# EAGLE schematic BFMC_Powerboard v0.2 (EAGLE 9.6.2)

## Sheet 1 of 3: Load SW and current sensing
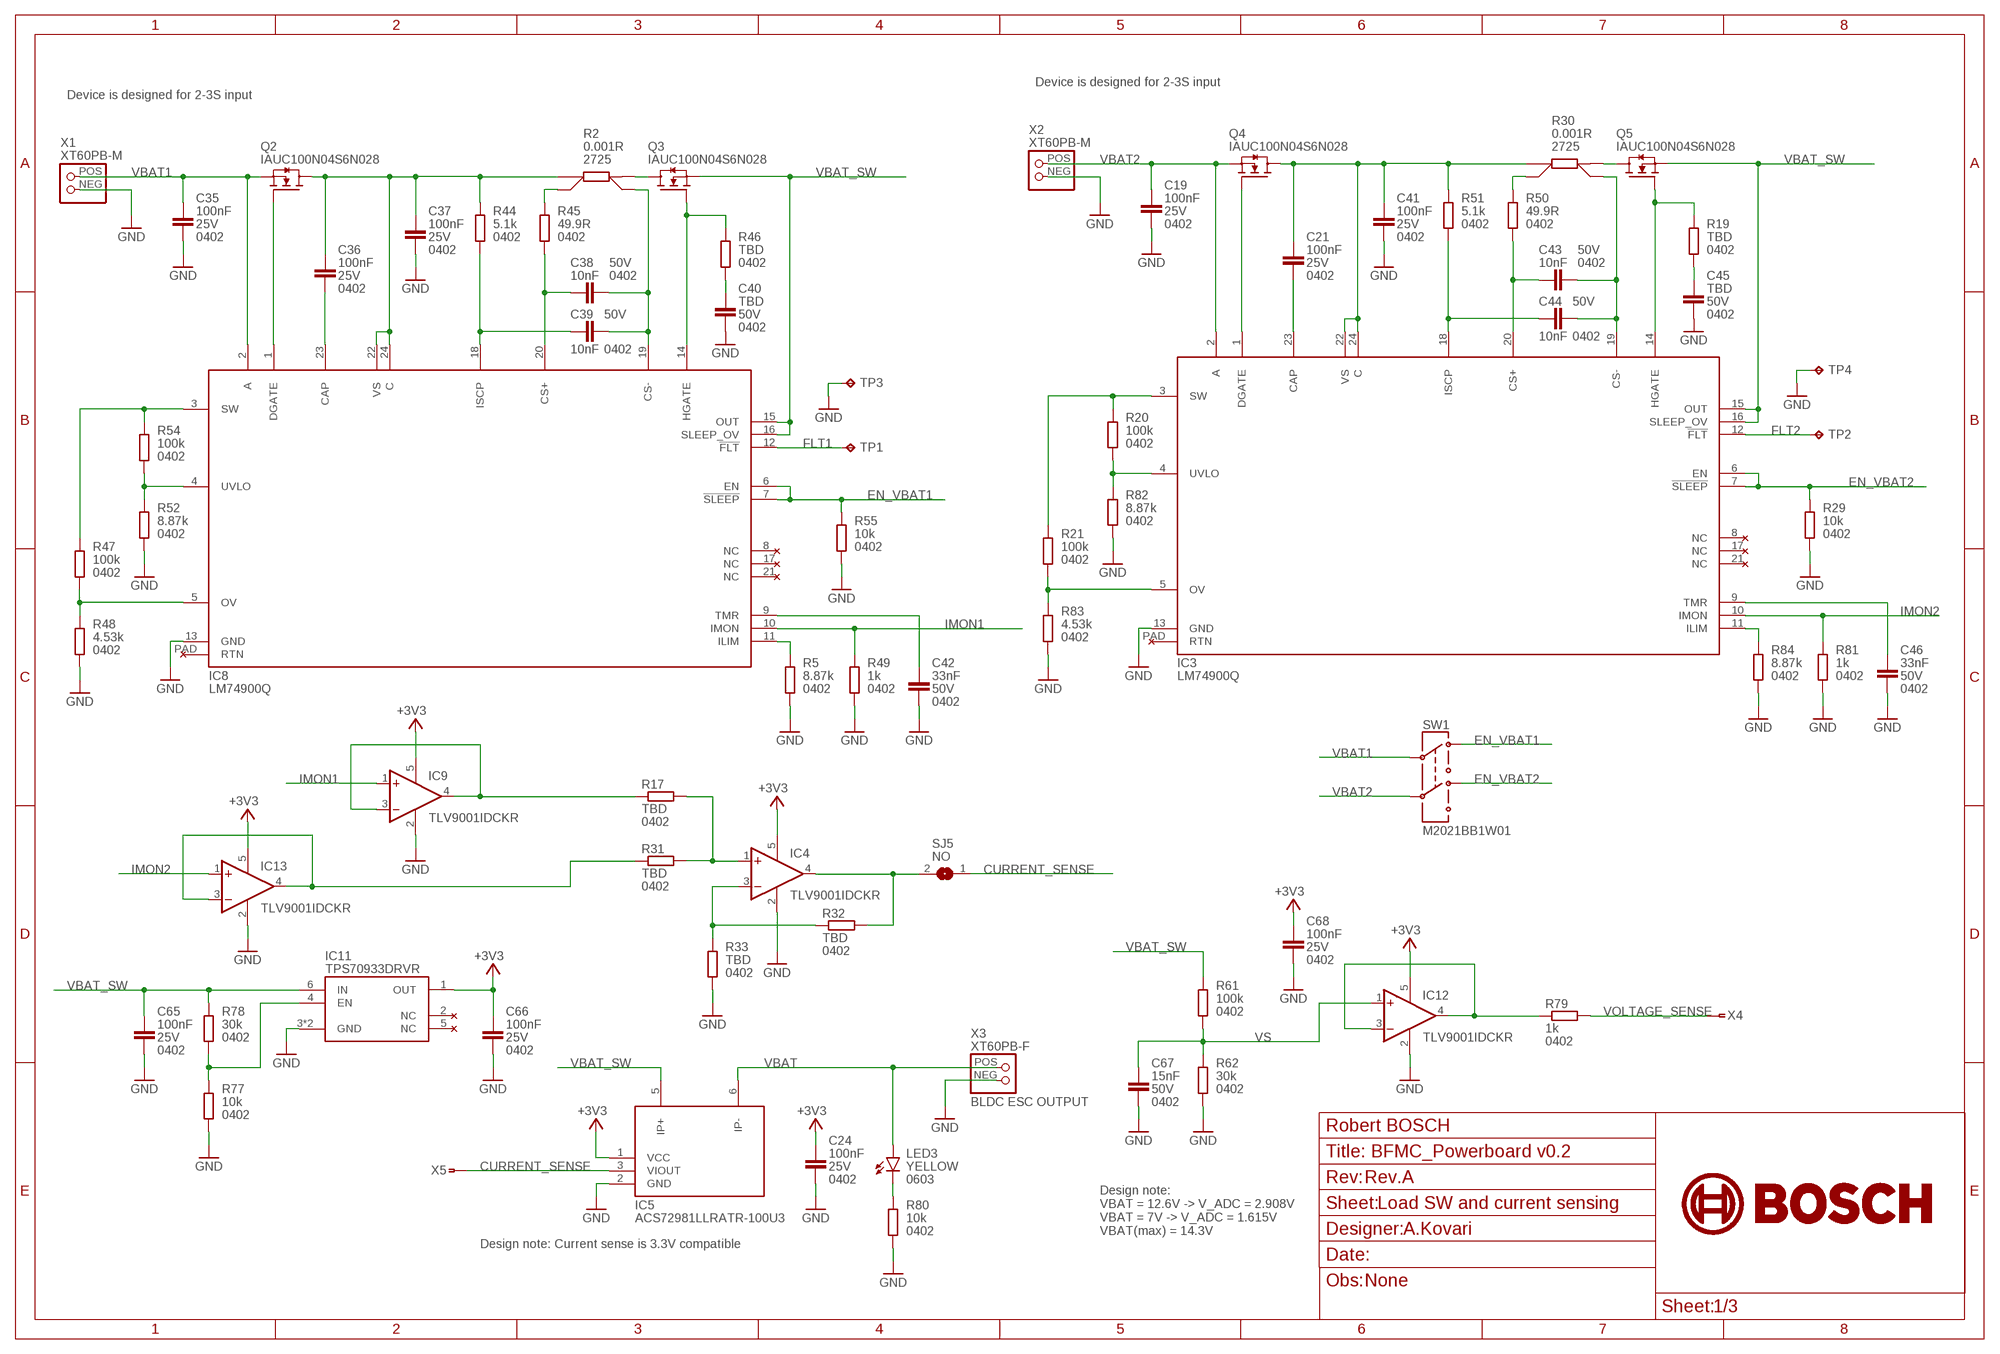
[diagram p0: schematic, sheet 1]
FRAME1 (_SCH_FRAME_A3): DNAME: A.Kovari; OBS: None; REVNUM: Rev.A

### Parts
C19  100nF  CL05B104KA5NNNC  [C0402_IPC]
C21  100nF  CL05B104KA5NNNC  [C0402_IPC]
C24  100nF  CL05B104KA5NNNC  [C0402_IPC]
C35  100nF  CL05B104KA5NNNC  [C0402_IPC]
C36  100nF  CL05B104KA5NNNC  [C0402_IPC]
C37  100nF  CL05B104KA5NNNC  [C0402_IPC]
C38  10nF  GCM155R71H103KA55D  [C0402_IPC]
C39  10nF  GCM155R71H103KA55D  [C0402_IPC]
C40  TBD  GCM155R71H103KA55D  [C0402_IPC]
C41  100nF  CL05B104KA5NNNC  [C0402_IPC]
C42  33nF  CGA2B3X7R1H333K050BB  [C0402_IPC]
C43  10nF  GCM155R71H103KA55D  [C0402_IPC]
C44  10nF  GCM155R71H103KA55D  [C0402_IPC]
C45  TBD  GCM155R71H103KA55D  [C0402_IPC]
C46  33nF  CGA2B3X7R1H333K050BB  [C0402_IPC]
C65  100nF  CL05B104KA5NNNC  [C0402_IPC]
C66  100nF  CL05B104KA5NNNC  [C0402_IPC]
C67  15nF  GRM155R71H153KA12J  [C0402_IPC]
C68  100nF  CL05B104KA5NNNC  [C0402_IPC]
IC3  LM74900Q  [QFN24-4X4]
IC4  TLV9001IDCKR  [SC70-5]
IC5  ACS72981LLRATR-100U3  [ACS72981]
IC8  LM74900Q  [QFN24-4X4]
IC9  TLV9001IDCKR  [SC70-5]
IC11  TPS70933DRVR  [WSON6_2X2MM_NO_SILK]
IC12  TLV9001IDCKR  [SC70-5]
IC13  TLV9001IDCKR  [SC70-5]
LED3  YELLOW  150060YS75000  [CHIPLED_0603]
Q2  IAUC100N04S6N028  IAUC100N04S6N028ATMA1  [PG-TDSON-8]
Q3  IAUC100N04S6N028  IAUC100N04S6N028ATMA1  [PG-TDSON-8]
Q4  IAUC100N04S6N028  IAUC100N04S6N028ATMA1  [PG-TDSON-8]
Q5  IAUC100N04S6N028  IAUC100N04S6N028ATMA1  [PG-TDSON-8]
R2  0.001R  CST272FK-13-R001AA  [CRS272]
R5  8.87k  RC0402FR-078K87L  [R0402_IPC]
R17  TBD  RC0402FR-131KL  [R0402_IPC]
R19  TBD  RC0402FR-1349R9L  [R0402_IPC]
R20  100k  RC0402FR-13100KL  [R0402_IPC]
R21  100k  RC0402FR-13100KL  [R0402_IPC]
R29  10k  RC0402FR-1310KL  [R0402_IPC]
R30  0.001R  CST272FK-13-R001AA  [CRS272]
R31  TBD  RC0402FR-131KL  [R0402_IPC]
R32  TBD  RC0402FR-131KL  [R0402_IPC]
R33  TBD  RC0402FR-131KL  [R0402_IPC]
R44  5.1k  RC0402FR-135K1L  [R0402_IPC]
R45  49.9R  RC0402FR-1349R9L  [R0402_IPC]
R46  TBD  RC0402FR-1349R9L  [R0402_IPC]
R47  100k  RC0402FR-13100KL  [R0402_IPC]
R48  4.53k  RC0402FR-074K53L  [R0402_IPC]
R49  1k  RC0402FR-131KL  [R0402_IPC]
R50  49.9R  RC0402FR-1349R9L  [R0402_IPC]
R51  5.1k  RC0402FR-135K1L  [R0402_IPC]
R52  8.87k  RC0402FR-078K87L  [R0402_IPC]
R54  100k  RC0402FR-13100KL  [R0402_IPC]
R55  10k  RC0402FR-1310KL  [R0402_IPC]
R61  100k  RC0402FR-13100KL  [R0402_IPC]
R62  30k  RC0402FR-1330KL  [R0402_IPC]
R77  10k  RC0402FR-1310KL  [R0402_IPC]
R78  30k  RC0402FR-1330KL  [R0402_IPC]
R79  1k  RC0402FR-131KL  [R0402_IPC]
R80  10k  RC0402FR-1310KL  [R0402_IPC]
R81  1k  RC0402FR-131KL  [R0402_IPC]
R82  8.87k  RC0402FR-078K87L  [R0402_IPC]
R83  4.53k  RC0402FR-074K53L  [R0402_IPC]
R84  8.87k  RC0402FR-078K87L  [R0402_IPC]
SJ5  NO  SJ_1.5X1_NO  [SJ_1X1.5_NO]
SW1  M2021BB1W01  [M2021BB1W01]
TP1  TPTP13R  [TP13R]
TP2  TPTP13R  [TP13R]
TP3  TPTP13R  [TP13R]
TP4  TPTP13R  [TP13R]
X1  XT60PB-M  [XT60PB]
X2  XT60PB-M  [XT60PB]
X3  XT60PB-F  [XT60PB]
X4  ZFKDSA1-W-6,35  [1704994]
X5  ZFKDSA1-W-6,35  [1704994]

### Nets
+3V3: C24.1 C66.1 C68.1 IC4.5(V+) IC5.1(VCC) IC9.5(V+) IC11.1(OUT) IC12.5(V+) IC13.5(V+) ; also sheet 2,3
CURRENT_SENSE: IC5.3(VIOUT) SJ5.1 X5.1 X5.2
EN_VBAT1: IC8.6(EN) IC8.7(!SLEEP) R55.2 SW1.3
EN_VBAT2: IC3.6(EN) IC3.7(!SLEEP) R29.2 SW1.6
FLT1: IC8.12(!FLT) TP1.TP
FLT2: IC3.12(!FLT) TP2.TP
GND: C19.2 C24.2 C35.2 C37.2 C40.1 C41.2 C42.2 C45.1 C46.2 C65.2 C66.2 C67.2 C68.2 IC3.13(GND) IC4.2(V-) IC5.2(GND) IC8.13(GND) IC9.2(V-) IC11.3(GND) IC11.EP(GND) IC12.2(V-) IC13.2(V-) R5.1 R29.1 R33.1 R48.1 R49.1 R52.1 R55.1 R62.1 R77.1 R80.1 R81.1 R82.1 R83.1 R84.1 TP3.TP TP4.TP X1.NEG X2.NEG X3.NEG ; also sheet 2,3
IMON1: IC8.10(IMON) IC9.1(+IN) R49.2
IMON2: IC3.10(IMON) IC13.1(+IN) R81.2
N$12: IC8.1(DGATE) Q2.4(G)
N$15: IC3.1(DGATE) Q4.4(G)
N$17: C21.2 IC3.23(CAP)
N$18: C21.1 C41.1 IC3.22(VS) IC3.24(C) Q4.5(D) Q4.6(D) Q4.7(D) Q4.8(D) Q4.TH(D) R30.1A R51.2
N$19: IC3.14(HGATE) Q5.4(G) R19.2
N$20: IC4.1(+IN) R17.2 R31.2
N$22: C44.1 IC3.18(ISCP) R51.1
N$23: R30.1B R50.2
N$24: C43.2 C44.2 IC3.19(CS-) R30.2B
N$25: Q5.5(D) Q5.6(D) Q5.7(D) Q5.8(D) Q5.TH(D) R30.2A
N$26: IC4.4(OUT) R32.2 SJ5.2
N$27: C43.1 IC3.20(CS+) R50.1
N$28: C45.2 R19.1
N$29: IC4.3(-IN) R32.1 R33.2
N$33: IC9.3(-IN) IC9.4(OUT) R17.1
N$34: IC13.3(-IN) IC13.4(OUT) R31.1
N$43: C36.2 IC8.23(CAP)
N$45: C36.1 C37.1 IC8.22(VS) IC8.24(C) Q2.5(D) Q2.6(D) Q2.7(D) Q2.8(D) Q2.TH(D) R2.1A R44.2
N$46: IC8.14(HGATE) Q3.4(G) R46.2
N$47: C39.1 IC8.18(ISCP) R44.1
N$48: IC8.3(SW) R47.2 R54.2
N$49: R2.1B R45.2
N$50: C38.2 C39.2 IC8.19(CS-) R2.2B
N$51: Q3.5(D) Q3.6(D) Q3.7(D) Q3.8(D) Q3.TH(D) R2.2A
N$52: C38.1 IC8.20(CS+) R45.1
N$53: C40.2 R46.1
N$54: IC8.11(ILIM) R5.2
N$55: IC3.11(ILIM) R84.2
N$56: C42.1 IC8.9(TMR)
N$57: IC8.4(UVLO) R52.2 R54.1
N$61: IC8.5(OV) R47.1 R48.2
N$78: IC12.3(-IN) IC12.4(OUT) R79.1
N$79: LED3.C R80.2
N$91: IC11.4(EN) R77.2 R78.1
N$92: C46.1 IC3.9(TMR)
N$93: IC3.3(SW) R20.2 R21.2
N$94: IC3.4(UVLO) R20.1 R82.2
N$95: IC3.5(OV) R21.1 R83.2
VBAT: IC5.6(IP-) LED3.A X3.POS ; also sheet 2,3
VBAT1: C35.1 IC8.2(A) Q2.1(S) Q2.2(S) Q2.3(S) SW1.2 X1.POS
VBAT2: C19.1 IC3.2(A) Q4.1(S) Q4.2(S) Q4.3(S) SW1.5 X2.POS
VBAT_SW: C65.1 IC3.15(OUT) IC3.16(SLEEP_OV) IC5.5(IP+) IC8.15(OUT) IC8.16(SLEEP_OV) IC11.6(IN) Q3.1(S) Q3.2(S) Q3.3(S) Q5.1(S) Q5.2(S) Q5.3(S) R61.2 R78.2
VOLTAGE_SENSE: R79.2 X4.1 X4.2
VS: C67.1 IC12.1(+IN) R61.1 R62.2
Unconnected: IC3.8(NC) IC3.17(NC) IC3.21(NC) IC3.PAD(RTN) IC8.8(NC) IC8.17(NC) IC8.21(NC) IC8.PAD(RTN) IC11.2(NC) IC11.5(NC)

### Notes on the sheet
- Device is designed for 2-3S input
- Device is designed for 2-3S input
- BLDC ESC OUTPUT
- Design note: 
  VBAT = 12.6V -> V_ADC = 2.908V
  VBAT = 7V -> V_ADC = 1.615V
  VBAT(max) = 14.3V
- Design note: Current sense is 3.3V compatible

## Sheet 2 of 3: DCDC Buck converters
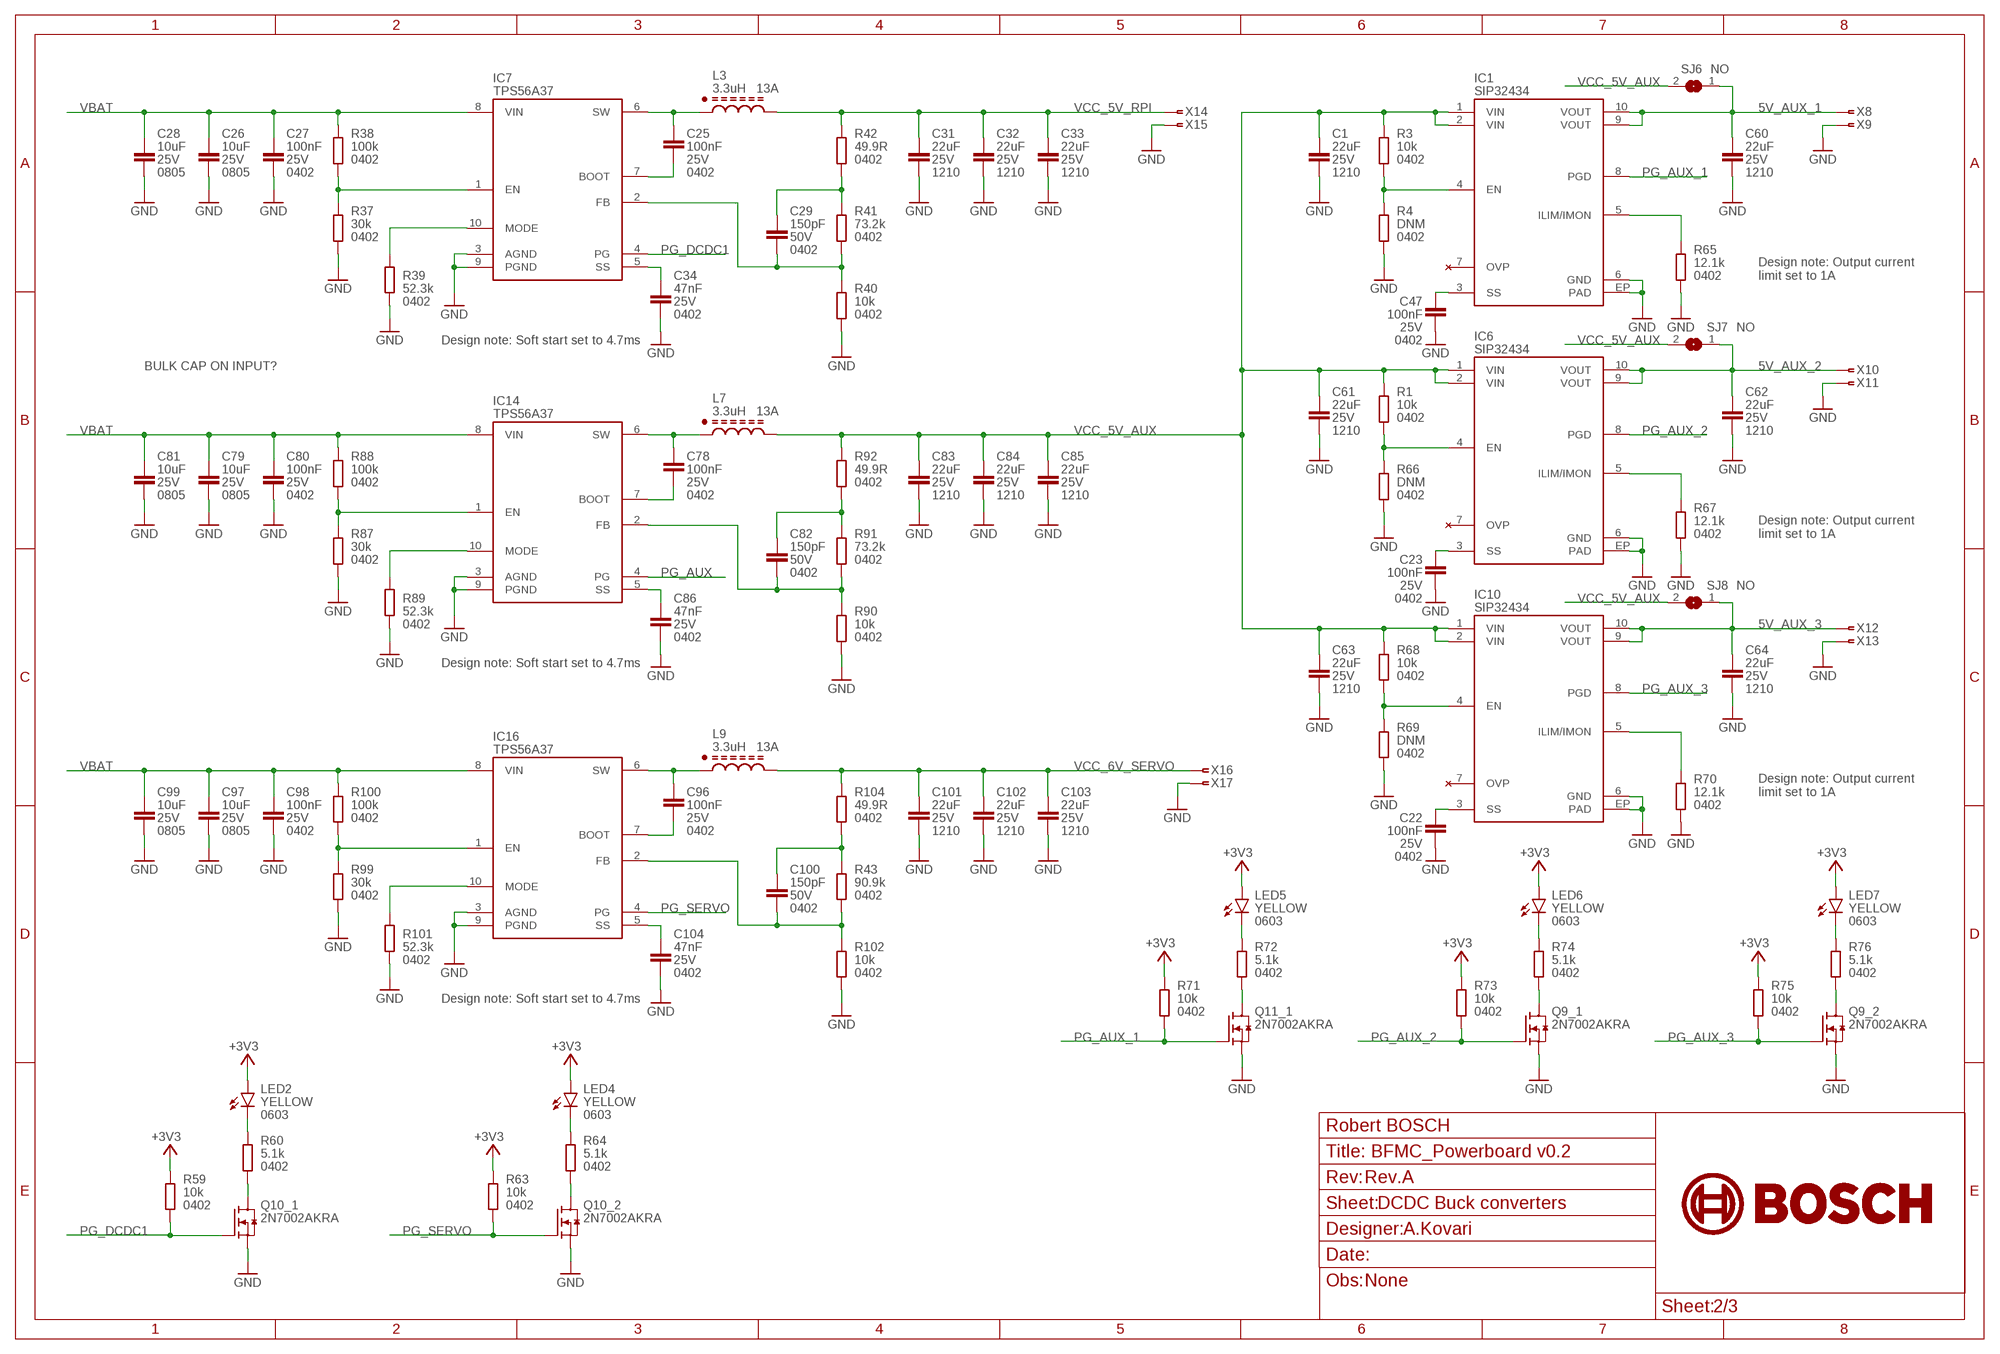
[diagram p1: schematic, sheet 2]
FRAME3 (_SCH_FRAME_A3): DNAME: A.Kovari; OBS: None; REVNUM: Rev.A

### Parts
C1  22uF  CL32A226KAJNNNE  [C1210]
C22  100nF  CL05B104KA5NNNC  [C0402_IPC]
C23  100nF  CL05B104KA5NNNC  [C0402_IPC]
C25  100nF  CL05B104KA5NNNC  [C0402_IPC]
C26  10uF  GRM21BR61E106KA73K  [C0805]
C27  100nF  CL05B104KA5NNNC  [C0402_IPC]
C28  10uF  GRM21BR61E106KA73K  [C0805]
C29  150pF  GCM1555C1H151JA16J  [C0402_IPC]
C31  22uF  CL32A226KAJNNNE  [C1210]
C32  22uF  CL32A226KAJNNNE  [C1210]
C33  22uF  CL32A226KAJNNNE  [C1210]
C34  47nF  CL05B473KA5NNNC  [C0402_IPC]
C47  100nF  CL05B104KA5NNNC  [C0402_IPC]
C60  22uF  CL32A226KAJNNNE  [C1210]
C61  22uF  CL32A226KAJNNNE  [C1210]
C62  22uF  CL32A226KAJNNNE  [C1210]
C63  22uF  CL32A226KAJNNNE  [C1210]
C64  22uF  CL32A226KAJNNNE  [C1210]
C78  100nF  CL05B104KA5NNNC  [C0402_IPC]
C79  10uF  GRM21BR61E106KA73K  [C0805]
C80  100nF  CL05B104KA5NNNC  [C0402_IPC]
C81  10uF  GRM21BR61E106KA73K  [C0805]
C82  150pF  GCM1555C1H151JA16J  [C0402_IPC]
C83  22uF  CL32A226KAJNNNE  [C1210]
C84  22uF  CL32A226KAJNNNE  [C1210]
C85  22uF  CL32A226KAJNNNE  [C1210]
C86  47nF  CL05B473KA5NNNC  [C0402_IPC]
C96  100nF  CL05B104KA5NNNC  [C0402_IPC]
C97  10uF  GRM21BR61E106KA73K  [C0805]
C98  100nF  CL05B104KA5NNNC  [C0402_IPC]
C99  10uF  GRM21BR61E106KA73K  [C0805]
C100  150pF  GCM1555C1H151JA16J  [C0402_IPC]
C101  22uF  CL32A226KAJNNNE  [C1210]
C102  22uF  CL32A226KAJNNNE  [C1210]
C103  22uF  CL32A226KAJNNNE  [C1210]
C104  47nF  CL05B473KA5NNNC  [C0402_IPC]
IC1  SIP32434  [DFN10-3X3]
IC6  SIP32434  [DFN10-3X3]
IC7  TPS56A37  [VQFN-HR-RPA]
IC10  SIP32434  [DFN10-3X3]
IC14  TPS56A37  [VQFN-HR-RPA]
IC16  TPS56A37  [VQFN-HR-RPA]
L3  3.3uH  EXLA1V0705-3R3-R  [EXLA1V0705]
L7  3.3uH  EXLA1V0705-3R3-R  [EXLA1V0705]
L9  3.3uH  EXLA1V0705-3R3-R  [EXLA1V0705]
LED2  YELLOW  150060YS75000  [CHIPLED_0603]
LED4  YELLOW  150060YS75000  [CHIPLED_0603]
LED5  YELLOW  150060YS75000  [CHIPLED_0603]
LED6  YELLOW  150060YS75000  [CHIPLED_0603]
LED7  YELLOW  150060YS75000  [CHIPLED_0603]
Q9  2N7002AKRA  [DFN1412-6]
Q10  2N7002AKRA  [DFN1412-6]
Q11  2N7002AKRA  [DFN1412-6]
R1  10k  RC0402FR-1310KL  [R0402_IPC]
R3  10k  RC0402FR-1310KL  [R0402_IPC]
R4  DNM  RC0402FR-1310KL  [R0402_IPC]
R37  30k  RC0402FR-1330KL  [R0402_IPC]
R38  100k  RC0402FR-13100KL  [R0402_IPC]
R39  52.3k  RC0402FR-1352K3L  [R0402_IPC]
R40  10k  RC0402FR-1310KL  [R0402_IPC]
R41  73.2k  RC0402FR-1373K2L  [R0402_IPC]
R42  49.9R  RC0402FR-1349R9L  [R0402_IPC]
R43  90.9k  RC0402FR-0790K9L  [R0402_IPC]
R59  10k  RC0402FR-1310KL  [R0402_IPC]
R60  5.1k  RC0402FR-135K1L  [R0402_IPC]
R63  10k  RC0402FR-1310KL  [R0402_IPC]
R64  5.1k  RC0402FR-135K1L  [R0402_IPC]
R65  12.1k  RC0402FR-0712K1L  [R0402_IPC]
R66  DNM  RC0402FR-1310KL  [R0402_IPC]
R67  12.1k  RC0402FR-0712K1L  [R0402_IPC]
R68  10k  RC0402FR-1310KL  [R0402_IPC]
R69  DNM  RC0402FR-1310KL  [R0402_IPC]
R70  12.1k  RC0402FR-0712K1L  [R0402_IPC]
R71  10k  RC0402FR-1310KL  [R0402_IPC]
R72  5.1k  RC0402FR-135K1L  [R0402_IPC]
R73  10k  RC0402FR-1310KL  [R0402_IPC]
R74  5.1k  RC0402FR-135K1L  [R0402_IPC]
R75  10k  RC0402FR-1310KL  [R0402_IPC]
R76  5.1k  RC0402FR-135K1L  [R0402_IPC]
R87  30k  RC0402FR-1330KL  [R0402_IPC]
R88  100k  RC0402FR-13100KL  [R0402_IPC]
R89  52.3k  RC0402FR-1352K3L  [R0402_IPC]
R90  10k  RC0402FR-1310KL  [R0402_IPC]
R91  73.2k  RC0402FR-1373K2L  [R0402_IPC]
R92  49.9R  RC0402FR-1349R9L  [R0402_IPC]
R99  30k  RC0402FR-1330KL  [R0402_IPC]
R100  100k  RC0402FR-13100KL  [R0402_IPC]
R101  52.3k  RC0402FR-1352K3L  [R0402_IPC]
R102  10k  RC0402FR-1310KL  [R0402_IPC]
R104  49.9R  RC0402FR-1349R9L  [R0402_IPC]
SJ6  NO  SJ_1.5X1_NO  [SJ_1X1.5_NO]
SJ7  NO  SJ_1.5X1_NO  [SJ_1X1.5_NO]
SJ8  NO  SJ_1.5X1_NO  [SJ_1X1.5_NO]
X8  ZFKDSA1-W-6,35  [1704994]
X9  ZFKDSA1-W-6,35  [1704994]
X10  ZFKDSA1-W-6,35  [1704994]
X11  ZFKDSA1-W-6,35  [1704994]
X12  ZFKDSA1-W-6,35  [1704994]
X13  ZFKDSA1-W-6,35  [1704994]
X14  ZFKDSA1-W-6,35  [1704994]
X15  ZFKDSA1-W-6,35  [1704994]
X16  ZFKDSA1-W-6,35  [1704994]
X17  ZFKDSA1-W-6,35  [1704994]

### Nets
5V_AUX_1: C60.1 IC1.9(VOUT) IC1.10(VOUT) SJ6.1 X8.1 X8.2
5V_AUX_2: C62.1 IC6.9(VOUT) IC6.10(VOUT) SJ7.1 X10.1 X10.2
5V_AUX_3: C64.1 IC10.9(VOUT) IC10.10(VOUT) SJ8.1 X12.1 X12.2
+3V3: LED2.A LED4.A LED5.A LED6.A LED7.A R59.2 R63.2 R71.2 R73.2 R75.2 ; also sheet 1,3
GND: C1.2 C22.2 C23.2 C26.2 C27.2 C28.2 C31.2 C32.2 C33.2 C34.2 C47.2 C60.2 C61.2 C62.2 C63.2 C64.2 C79.2 C80.2 C81.2 C83.2 C84.2 C85.2 C86.2 C97.2 C98.2 C99.2 C101.2 C102.2 C103.2 C104.2 IC1.6(GND) IC1.EP(PAD) IC6.6(GND) IC6.EP(PAD) IC7.3(AGND) IC7.9(PGND) IC10.6(GND) IC10.EP(PAD) IC14.3(AGND) IC14.9(PGND) IC16.3(AGND) IC16.9(PGND) Q9.1(_1:S) Q9.4(_2:S) Q10.1(_1:S) Q10.4(_2:S) Q11.1(_1:S) R4.1 R37.1 R39.1 R40.1 R65.1 R66.1 R67.1 R69.1 R70.1 R87.1 R89.1 R90.1 R99.1 R101.1 R102.1 X9.1 X9.2 X11.1 X11.2 X13.1 X13.2 X15.1 X15.2 X17.1 X17.2 ; also sheet 1,3
N$1: IC6.5(ILIM/IMON) R67.2
N$2: IC1.5(ILIM/IMON) R65.2
N$3: IC1.4(EN) R3.1 R4.2
N$30: C22.1 IC10.3(SS)
N$31: C23.1 IC6.3(SS)
N$32: C47.1 IC1.3(SS)
N$37: C25.1 IC7.6(SW) L3.1
N$38: C25.2 IC7.7(BOOT)
N$39: C34.1 IC7.5(SS)
N$40: IC7.1(EN) R37.2 R38.1
N$41: C29.2 IC7.2(FB) R40.2 R41.1
N$42: IC7.10(MODE) R39.2
N$44: C29.1 R41.2 R42.1
N$76: Q10.6(_1:D) Q10.7(_1:D) R60.1
N$77: LED2.C R60.2
N$80: Q10.3(_2:D) Q10.8(_2:D) R64.1
N$81: LED4.C R64.2
N$82: IC6.4(EN) R1.1 R66.2
N$83: IC10.5(ILIM/IMON) R70.2
N$84: IC10.4(EN) R68.1 R69.2
N$85: Q11.6(_1:D) Q11.7(_1:D) R72.1
N$86: LED5.C R72.2
N$87: Q9.6(_1:D) Q9.7(_1:D) R74.1
N$88: LED6.C R74.2
N$89: Q9.3(_2:D) Q9.8(_2:D) R76.1
N$90: LED7.C R76.2
N$99: C78.1 IC14.6(SW) L7.1
N$100: C78.2 IC14.7(BOOT)
N$101: IC14.1(EN) R87.2 R88.1
N$102: IC14.10(MODE) R89.2
N$103: C82.2 IC14.2(FB) R90.2 R91.1
N$104: C82.1 R91.2 R92.1
N$105: C86.1 IC14.5(SS)
N$113: C96.1 IC16.6(SW) L9.1
N$114: C96.2 IC16.7(BOOT)
N$115: IC16.1(EN) R99.2 R100.1
N$116: IC16.10(MODE) R101.2
N$117: C100.2 IC16.2(FB) R43.1 R102.2
N$118: C100.1 R43.2 R104.1
N$119: C104.1 IC16.5(SS)
PG_AUX: IC14.4(PG)
PG_AUX_1: IC1.8(PGD) Q11.2(_1:G) R71.1
PG_AUX_2: IC6.8(PGD) Q9.2(_1:G) R73.1
PG_AUX_3: IC10.8(PGD) Q9.5(_2:G) R75.1
PG_DCDC1: IC7.4(PG) Q10.2(_1:G) R59.1
PG_SERVO: IC16.4(PG) Q10.5(_2:G) R63.1
VBAT: C26.1 C27.1 C28.1 C79.1 C80.1 C81.1 C97.1 C98.1 C99.1 IC7.8(VIN) IC14.8(VIN) IC16.8(VIN) R38.2 R88.2 R100.2 ; also sheet 1,3
VCC_5V_AUX: C1.1 C61.1 C63.1 C83.1 C84.1 C85.1 IC1.1(VIN) IC1.2(VIN) IC6.1(VIN) IC6.2(VIN) IC10.1(VIN) IC10.2(VIN) L7.2 R1.2 R3.2 R68.2 R92.2 SJ6.2 SJ7.2 SJ8.2 ; also sheet 3
VCC_5V_RPI: C31.1 C32.1 C33.1 L3.2 R42.2 X14.1 X14.2
VCC_6V_SERVO: C101.1 C102.1 C103.1 L9.2 R104.2 X16.1 X16.2
Unconnected: IC1.7(OVP) IC6.7(OVP) IC10.7(OVP)

### Notes on the sheet
- Design note: Output current
  limit set to 1A
- Design note: Soft start set to 4.7ms
- BULK CAP ON INPUT?
- Design note: Output current
  limit set to 1A
- Design note: Soft start set to 4.7ms
- Design note: Output current
  limit set to 1A
- Design note: Soft start set to 4.7ms

## Sheet 3 of 3: DCDC Boost converter
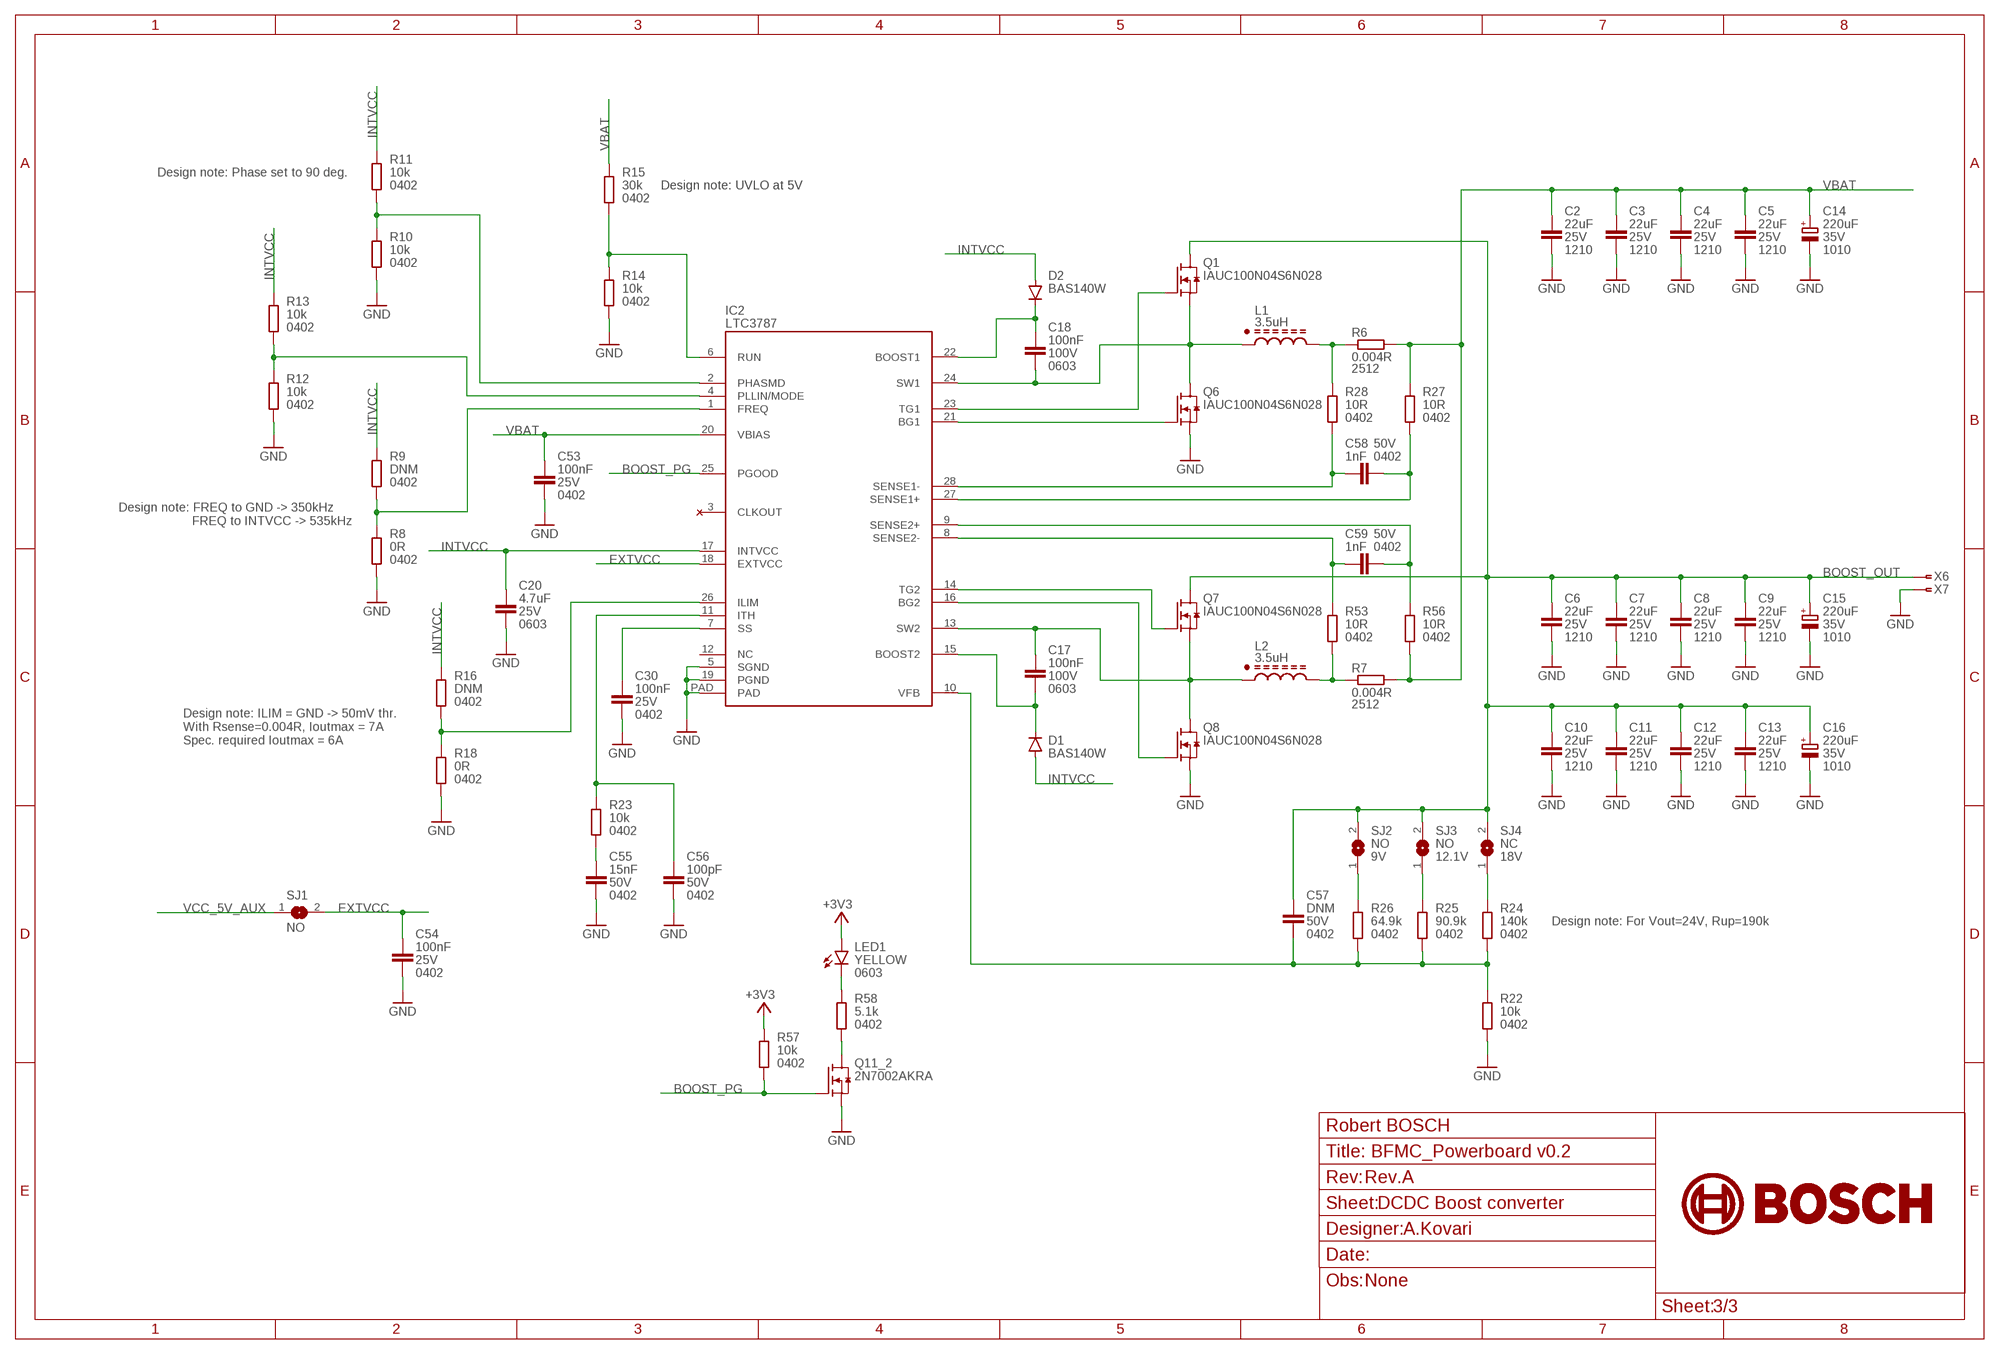
[diagram p2: schematic, sheet 3]
FRAME2 (_SCH_FRAME_A3): DNAME: A.Kovari; OBS: None; REVNUM: Rev.A

### Parts
C2  22uF  CL32A226KAJNNNE  [C1210]
C3  22uF  CL32A226KAJNNNE  [C1210]
C4  22uF  CL32A226KAJNNNE  [C1210]
C5  22uF  CL32A226KAJNNNE  [C1210]
C6  22uF  CL32A226KAJNNNE  [C1210]
C7  22uF  CL32A226KAJNNNE  [C1210]
C8  22uF  CL32A226KAJNNNE  [C1210]
C9  22uF  CL32A226KAJNNNE  [C1210]
C10  22uF  CL32A226KAJNNNE  [C1210]
C11  22uF  CL32A226KAJNNNE  [C1210]
C12  22uF  CL32A226KAJNNNE  [C1210]
C13  22uF  CL32A226KAJNNNE  [C1210]
C14  220uF  865060557008  [CAP_POL_1010]
C15  220uF  865060557008  [CAP_POL_1010]
C16  220uF  865060557008  [CAP_POL_1010]
C17  100nF  CL10B104KC8NNNC  [C0603]
C18  100nF  CL10B104KC8NNNC  [C0603]
C20  4.7uF  C1608X5R1E475K080AC  [C0603]
C30  100nF  CL05B104KA5NNNC  [C0402_IPC]
C53  100nF  CL05B104KA5NNNC  [C0402_IPC]
C54  100nF  CL05B104KA5NNNC  [C0402_IPC]
C55  15nF  GRM155R71H153KA12J  [C0402_IPC]
C56  100pF  GRM1555C1H101JA01D  [C0402_IPC]
C57  DNM  GJM1555C1H470FB01D  [C0402_IPC]
C58  1nF  GRM1555C1H102JA01D  [C0402_IPC]
C59  1nF  GRM1555C1H102JA01D  [C0402_IPC]
D1  BAS140W  BAS140WE6327HTSA1  [SOD323-R]
D2  BAS140W  BAS140WE6327HTSA1  [SOD323-R]
IC2  LTC3787  [UFD-QFN28-4X5MM]
L1  3.5uH  7447709003  [7447709003]
L2  3.5uH  7447709003  [7447709003]
LED1  YELLOW  150060YS75000  [CHIPLED_0603]
Q1  IAUC100N04S6N028  IAUC100N04S6N028ATMA1  [PG-TDSON-8]
Q6  IAUC100N04S6N028  IAUC100N04S6N028ATMA1  [PG-TDSON-8]
Q7  IAUC100N04S6N028  IAUC100N04S6N028ATMA1  [PG-TDSON-8]
Q8  IAUC100N04S6N028  IAUC100N04S6N028ATMA1  [PG-TDSON-8]
R6  0.004R  CRF2512-FZ-R004ELF  [R2512]
R7  0.004R  CRF2512-FZ-R004ELF  [R2512]
R8  0R  RC0402JR-100RL  [R0402_IPC]
R9  DNM  RC0402JR-100RL  [R0402_IPC]
R10  10k  RC0402FR-1310KL  [R0402_IPC]
R11  10k  RC0402FR-1310KL  [R0402_IPC]
R12  10k  RC0402FR-1310KL  [R0402_IPC]
R13  10k  RC0402FR-1310KL  [R0402_IPC]
R14  10k  RC0402FR-1310KL  [R0402_IPC]
R15  30k  RC0402FR-1330KL  [R0402_IPC]
R16  DNM  RC0402JR-100RL  [R0402_IPC]
R18  0R  RC0402JR-100RL  [R0402_IPC]
R22  10k  RC0402FR-1310KL  [R0402_IPC]
R23  10k  RC0402FR-1310KL  [R0402_IPC]
R24  140k  RC0402FR-13140KL  [R0402_IPC]
R25  90.9k  RC0402FR-0790K9L  [R0402_IPC]
R26  64.9k  RC0402FR-1364K9L  [R0402_IPC]
R27  10R  RC0402FR-1310RL  [R0402_IPC]
R28  10R  RC0402FR-1310RL  [R0402_IPC]
R53  10R  RC0402FR-1310RL  [R0402_IPC]
R56  10R  RC0402FR-1310RL  [R0402_IPC]
R57  10k  RC0402FR-1310KL  [R0402_IPC]
R58  5.1k  RC0402FR-135K1L  [R0402_IPC]
SJ1  NO  SJ_1.5X1_NO  [SJ_1X1.5_NO]
SJ2  NO  SJ_1.5X1_NO  [SJ_1X1.5_NO]
SJ3  NO  SJ_1.5X1_NO  [SJ_1X1.5_NO]
SJ4  NC  SJ_1.5X1_NO  [SJ_1X1.5_NO]
X6  ZFKDSA1-W-6,35  [1704994]
X7  ZFKDSA1-W-6,35  [1704994]

### Nets
+3V3: LED1.A R57.2 ; also sheet 1,2
BOOST_OUT: C6.1 C7.1 C8.1 C9.1 C10.1 C11.1 C12.1 C13.1 C15.2(+) C16.2(+) C57.1 Q1.5(D) Q1.6(D) Q1.7(D) Q1.8(D) Q1.TH(D) Q7.5(D) Q7.6(D) Q7.7(D) Q7.8(D) Q7.TH(D) SJ2.2 SJ3.2 SJ4.2 X6.1 X6.2
BOOST_PG: IC2.25(PGOOD) Q11.5(_2:G) R57.1
EXTVCC: C54.1 IC2.18(EXTVCC) SJ1.2
GND: C2.2 C3.2 C4.2 C5.2 C6.2 C7.2 C8.2 C9.2 C10.2 C11.2 C12.2 C13.2 C14.1(-) C15.1(-) C16.1(-) C20.2 C30.2 C53.2 C54.2 C55.2 C56.2 IC2.5(SGND) IC2.19(PGND) IC2.PAD Q6.1(S) Q6.2(S) Q6.3(S) Q8.1(S) Q8.2(S) Q8.3(S) Q11.4(_2:S) R8.1 R10.1 R12.1 R14.1 R18.1 R22.1 X7.1 X7.2 ; also sheet 1,2
INTVCC: C20.1 D1.A D2.A IC2.17(INTVCC) R9.2 R11.2 R13.2 R16.2
N$4: IC2.23(TG1) Q1.4(G)
N$5: IC2.21(BG1) Q6.4(G)
N$6: IC2.14(TG2) Q7.4(G)
N$7: IC2.16(BG2) Q8.4(G)
N$8: C17.1 IC2.13(SW2) L2.1 Q7.1(S) Q7.2(S) Q7.3(S) Q8.5(D) Q8.6(D) Q8.7(D) Q8.8(D) Q8.TH(D)
N$9: C18.2 IC2.24(SW1) L1.1 Q1.1(S) Q1.2(S) Q1.3(S) Q6.5(D) Q6.6(D) Q6.7(D) Q6.8(D) Q6.TH(D)
N$10: C58.1 IC2.28(SENSE1-) R28.1
N$13: C59.1 IC2.8(SENSE2-) R53.2
N$14: C17.2 D1.C IC2.15(BOOST2)
N$16: C18.1 D2.C IC2.22(BOOST1)
N$21: IC2.1(FREQ) R8.2 R9.1
N$58: IC2.4(PLLIN/MODE) R12.2 R13.1
N$59: C57.2 IC2.10(VFB) R22.2 R24.2 R25.1 R26.1
N$60: IC2.2(PHASMD) R10.2 R11.1
N$62: C30.1 IC2.7(SS)
N$63: IC2.6(RUN) R14.2 R15.1
N$64: C56.1 IC2.11(ITH) R23.2
N$65: IC2.26(ILIM) R16.1 R18.2
N$66: C55.1 R23.1
N$67: R24.1 SJ4.1
N$68: R26.2 SJ2.1
N$69: R25.2 SJ3.1
N$70: L1.2 R6.1 R28.2
N$71: C58.2 IC2.27(SENSE1+) R27.1
N$72: L2.2 R7.1 R53.1
N$73: C59.2 IC2.9(SENSE2+) R56.2
N$74: Q11.3(_2:D) Q11.8(_2:D) R58.1
N$75: LED1.C R58.2
VBAT: C2.1 C3.1 C4.1 C5.1 C14.2(+) C53.1 IC2.20(VBIAS) R6.2 R7.2 R15.2 R27.2 R56.1 ; also sheet 1,2
VCC_5V_AUX: SJ1.1 ; also sheet 2
Unconnected: IC2.3(CLKOUT) IC2.12(NC)

### Notes on the sheet
- Design note: Phase set to 90 deg.
- Design note: UVLO at 5V
- Design note: FREQ to GND -> 350kHz
                       FREQ to INTVCC -> 535kHz
- Design note: ILIM = GND -> 50mV thr.
  With Rsense=0.004R, Ioutmax = 7A
  Spec. required Ioutmax = 6A
- 9V | 12.1V | 18V
- Design note: For Vout=24V, Rup=190k

## Library data of the parts
C1-C13 C31-C33 C60-C64 C83-C85 C101-C103 = _nanolabs_rcl_mpn:CL32A226KAJNNNE: CAP CER 22UF 25V X7R 1210; DESCRIPTION: CAP CER 22UF 25V X7R 1210; MPN: CL32A226KAJNNNE; PACKAGE: 1210; VOLTAGE: 25V
C14-C16 = _nanolabs_rcl_mpn:865060557008: CAP ALUM 220UF 20% 35V SMD; DESCRIPTION: CAP ALUM 220UF 20% 35V SMD; MPN: 865060557008; PACKAGE: 1010; VOLTAGE: 35V
C17 C18 = _nanolabs_rcl_mpn:CL10B104KC8NNNC: CAP CER 0.1UF 100V X7R 0603; DESCRIPTION: CAP CER 0.1UF 100V X7R 0603; MPN: CL10B104KC8NNNC; PACKAGE: 0603; VOLTAGE: 100V
C19 C21-C25 C27 C30 C35-C37 C41 C47 C53 C54 C65 C66 C68 C78 C80 C96 C98 = _nanolabs_rcl_mpn:CL05B104KA5NNNC: CAP CER 0.1UF 25V X7R 0402; DESCRIPTION: CAP CER 0.1UF 25V X7R 0402; MPN: CL05B104KA5NNNC; PACKAGE: 0402; VOLTAGE: 25V
C20 = _nanolabs_rcl_mpn:C1608X5R1E475K080AC: CAP CER 4.7UF 25V X5R 0603; DESCRIPTION: CAP CER 4.7UF 25V X5R 0603; MPN: C1608X5R1E475K080AC; PACKAGE: 0603; VOLTAGE: 25V
C26 C28 C79 C81 C97 C99 = _nanolabs_rcl_mpn:GRM21BR61E106KA73K: CAP CER 10UF 25V X5R 0805; DESCRIPTION: CAP CER 10UF 25V X5R 0805; MPN: GRM21BR61E106KA73K; PACKAGE: 0805; VOLTAGE: 25V
C29 C82 C100 = _nanolabs_rcl_mpn:GCM1555C1H151JA16J: CAP CER 150PF 50V C0G/NP0 0402; DESCRIPTION: CAP CER 150PF 50V C0G/NP0 0402; MPN: GCM1555C1H151JA16J; PACKAGE: 0402; VOLTAGE: 50V
C34 C86 C104 = _nanolabs_rcl_mpn:CL05B473KA5NNNC: CAP CER 0.047UF 25V X7R 0402; DESCRIPTION: CAP CER 0.047UF 25V X7R 0402; MPN: CL05B473KA5NNNC; PACKAGE: 0402; VOLTAGE: 25V
C38-C40 C43-C45 = _nanolabs_rcl_mpn:GCM155R71H103KA55D: CAP CER 10NF 50V X7R 0402; DESCRIPTION: CAP CER 10NF 50V X7R 0402; MPN: GCM155R71H103KA55D; PACKAGE: 0402; VOLTAGE: 50V
C42 C46 = _nanolabs_rcl_mpn:CGA2B3X7R1H333K050BB: CAP CER 0.033UF 50V X7R 0402; DESCRIPTION: CAP CER 0.033UF 50V X7R 0402; MPN: CGA2B3X7R1H333K050BB; PACKAGE: 0402; VOLTAGE: 50V
C55 C67 = _nanolabs_rcl_mpn:GRM155R71H153KA12J: CAP CER 15NF 50V X7R 0402; DESCRIPTION: CAP CER 15NF 50V X7R 0402; MPN: GRM155R71H153KA12J; PACKAGE: 0402; VOLTAGE: 50V
C56 = _nanolabs_rcl_mpn:GRM1555C1H101JA01D: CAP CER 100PF 50V C0G/NP0 0402; DESCRIPTION: CAP CER 100PF 50V C0G/NP0 0402; MPN: GRM1555C1H101JA01D; PACKAGE: 0402; VOLTAGE: 50V
C57 = _nanolabs_rcl_mpn:GJM1555C1H470FB01D: CAP CER 47PF 50V C0G/NP0 0402E; DESCRIPTION: CAP CER 47PF 50V C0G/NP0 0402; MPN: GJM1555C1H470FB01D; PACKAGE: 0402; VOLTAGE: 50V
C58 C59 = _nanolabs_rcl_mpn:GRM1555C1H102JA01D: CAP CER 1000PF 50V C0G/NP0 0402; DESCRIPTION: CAP CER 1000PF 50V C0G/NP0 0402; MPN: GRM1555C1H102JA01D; PACKAGE: 0402; VOLTAGE: 50V
D1 D2 = _nanolabs_diodes:BAS140WE6327HTSA1: DIODE SCHOT 40V 120MA PGSOD3233D; DESCRIPTION: DIODE SCHOT 40V 120MA PGSOD3233D; MPN: BAS140WE6327HTSA1
IC1 IC6 IC10 = _nanolabs_ic:SIP32434: IC EFUSE 23V 6A 0.033R DFN-10; DESCRIPTION: IC EFUSE 23V 6A 0.033R DFN-10; MPN: SIP32434ADN-T1E4
IC2 = _nanolabs_ic:LTC3787: IC REG CTRLR BOOST 28QFN; DESCRIPTION: IC REG CTRLR BOOST 28QFN; MPN: LTC3787EUFD
IC3 IC8 = _nanolabs_ic:LM74900Q: IC IDEAL DIODE CTRL VQFN-24; DESCRIPTION: IC IDEAL DIODE CTRL VQFN-24; MPN: LM74900QRGERQ1
IC4 IC9 IC12 IC13 = _nanolabs_ic:TLV9001IDCKR: IC OPAMP CMOS 1 CIRCUIT SC70-5; DESCRIPTION: IC OPAMP CMOS 1 CIRCUIT SC70-5; MPN: TLV9001SIDCKR
IC5 = _nanolabs_ic:ACS72981LLRATR-100U3: IC CURRENT SENSOR 100A LINEAR HALL EFFECT; DESCRIPTION: IC CURRENT SENSOR 100A LINEAR HALL EFFECT; MPN: ACS72981LLRATR-100U3
IC7 IC14 IC16 = _nanolabs_ic:TPS56A37: IC REG BUCK ADJ 10A 10VQFN; DESCRIPTION: IC REG BUCK ADJ 10A 10VQFN; MPN: TPS56A37RPAR
IC11 = _nanolabs_ic:TPS70933DRVR: IC REG LINEAR 3.3V 150MA 6-WSON; DESCRIPTION: IC REG LINEAR 3.3V 150MA 6-WSON; MPN: TPS70933DRVR
L1 L2 = _nanolabs_rcl_mpn:7447709003: FIXED IND 3.5UH 11A 9 MOHM SMD; DESCRIPTION: FIXED IND 3.5UH 11A 9 MOHM SMD; MPN: 7447709003
L3 L7 L9 = _nanolabs_rcl_mpn:EXLA1V0705-3R3-R: IND MOLDED SHLD 3.3UH 10.0A; CURRENT: 13A; DESCRIPTION: IND MOLDED SHLD 3.3UH 10.0A; MPN: EXLA1V0705-3R3-R
LED1-LED7 = _nanolabs_diodes:150060YS75000: LED YELLOW CLEAR 0603 SMD; DESCRIPTION: LED YELLOW CLEAR 0603 SMD; MPN: 150060YS75000; PACKAGE: 0603
Q1-Q8 = _nanolabs_transistors:IAUC100N04S6N028ATMA1: NMOS 40V 100A 62W PG-TDSON-8; DESCRIPTION: NMOS 40V 100A 62W PG-TDSON-8; MPN: IAUC100N04S6N028
Q9-Q11 = _nanolabs_transistors:2N7002AKRA: MOSFET 2N-CH 60V 0.32A 6DFN; DESCRIPTION: MOSFET 2N-CH 60V 0.32A 6DFN; MPN: 2N7002AKRA-QZ
R1 R3 R4 R10-R14 R22 R23 R29 R40 R55 R57 R59 R63 R66 R68 R69 R71 R73 R75 R77 R80 R90 R102 = _nanolabs_rcl_mpn:RC0402FR-1310KL: RES 10K OHM 1% 1/16W 0402; DESCRIPTION: RES 10K OHM 1% 1/16W 0402; MPN: RC0402FR-1310KL; PACKAGE: 0402
R2 R30 = _nanolabs_rcl_mpn:CST272FK-13-R001AA: RES SMD SHUNT 0.001R 7W 1% 2725; DESCRIPTION: RES SMD SHUNT 0.001R 7W 1% 2725; MPN: CST272FK-13-R001AA; PACKAGE: 2725
R5 R52 R82 R84 = _nanolabs_rcl_mpn:RC0402FR-078K87L: RES 8.87K OHM 1% 1/16W 0402; DESCRIPTION: RES 8.87K OHM 1% 1/16W 0402; MPN: RC0402FR-078K87L; PACKAGE: 0402
R6 R7 = _nanolabs_rcl_mpn:CRF2512-FZ-R004ELF: RES 0.004 OHM 1% 2W 2512; DESCRIPTION: RES 0.004 OHM 1% 2W 2512; MPN: CRF2512-FZ-R004ELF; PACKAGE: 2512
R8 R9 R16 R18 = _nanolabs_rcl_mpn:RC0402JR-100RL: RES 0 OHM JUMPER 1/16W 0402; DESCRIPTION: RES 0 OHM JUMPER 1/16W 0402; MPN: RC0402JR-100RL; PACKAGE: 0402
R15 R37 R62 R78 R87 R99 = _nanolabs_rcl_mpn:RC0402FR-1330KL: RES 30K OHM 1% 1/16W 0402; DESCRIPTION: RES 30K OHM 1% 1/16W 0402; MPN: RC0402FR-1330KL; PACKAGE: 0402
R17 R31-R33 R49 R79 R81 = _nanolabs_rcl_mpn:RC0402FR-131KL: RES 1K OHM 1% 1/16W 0402; DESCRIPTION: RES 1K OHM 1% 1/16W 0402; MPN: RC0402FR-131KL; PACKAGE: 0402
R19 R42 R45 R46 R50 R92 R104 = _nanolabs_rcl_mpn:RC0402FR-1349R9L: RES 49.9 OHM 1% 1/16W 0402; DESCRIPTION: RES 49.9 OHM 1% 1/16W 0402; MPN: RC0402FR-1349R9L; PACKAGE: 0402
R20 R21 R38 R47 R54 R61 R88 R100 = _nanolabs_rcl_mpn:RC0402FR-13100KL: RES 100K OHM 1% 1/16W 0402; DESCRIPTION: RES 100K OHM 1% 1/16W 0402; MPN: RC0402FR-13100KL; PACKAGE: 0402
R24 = _nanolabs_rcl_mpn:RC0402FR-13140KL: RES 140K OHM 1% 1/16W 0402; DESCRIPTION: RES 140K OHM 1% 1/16W 0402; MPN: RC0402FR-13140KL; PACKAGE: 0402
R25 R43 = _nanolabs_rcl_mpn:RC0402FR-0790K9L: RES 90.9K OHM 1% 1/16W 0402; DESCRIPTION: RES 90.9K OHM 1% 1/16W 0402; MPN: RC0402FR-0790K9L; PACKAGE: 0402
R26 = _nanolabs_rcl_mpn:RC0402FR-1364K9L: RES 64.9K OHM 1% 1/16W 0402; DESCRIPTION: RES 64.9K OHM 1% 1/16W 0402; MPN: RC0402FR-1364K9L; PACKAGE: 0402
R27 R28 R53 R56 = _nanolabs_rcl_mpn:RC0402FR-1310RL: RES 10 OHM 1% 1/16W 0402; DESCRIPTION: RES 10 OHM 1% 1/16W 0402; MPN: RC0402FR-1310RL; PACKAGE: 0402
R39 R89 R101 = _nanolabs_rcl_mpn:RC0402FR-1352K3L: RES 52.3K OHM 1% 1/16W 0402; DESCRIPTION: RES 52.3K OHM 1% 1/16W 0402; MPN: RC0402FR-1352K3L; PACKAGE: 0402
R41 R91 = _nanolabs_rcl_mpn:RC0402FR-1373K2L: RES 73.2K OHM 1% 1/16W 0402; DESCRIPTION: RES 73.2K OHM 1% 1/16W 0402; MPN: RC0402FR-1373K2L; PACKAGE: 0402
R44 R51 R58 R60 R64 R72 R74 R76 = _nanolabs_rcl_mpn:RC0402FR-135K1L: RES 5.1K OHM 1% 1/16W 0402; DESCRIPTION: RES 5.1K OHM 1% 1/16W 0402; MPN: RC0402FR-135K1L; PACKAGE: 0402
R48 R83 = _nanolabs_rcl_mpn:RC0402FR-074K53L: RES 4.53K OHM 1% 1/16W 0402; DESCRIPTION: RES 4.53K OHM 1% 1/16W 0402; MPN: RC0402FR-074K53L; PACKAGE: 0402
R65 R67 R70 = _nanolabs_rcl_mpn:RC0402FR-0712K1L: RES 12.1K OHM 1% 1/16W 0402; DESCRIPTION: RES 12.1K OHM 1% 1/16W 0402; MPN: RC0402FR-0712K1L; PACKAGE: 0402
SJ1-SJ8 = _nanolabs_misc:SJ
SW1 = _nanolabs_electromechanical:M2021BB1W01: SWITCH TOGGLE DPST 6A 125V; DESCRIPTION: SWITCH TOGGLE DPST 6A 125V; MPN: M2021BB1W01
TP1-TP4 = _nanolabs_misc:TP: Test pad
X1 X2 = _nanolabs_connectors:XT60PB: CONN XT-60 THT; DESCRIPTION: CONN XT-60 MALE THT; MPN: XT60PB-M
X3 = _nanolabs_connectors:XT60PB: CONN XT-60 THT; DESCRIPTION: CONN XT-60 FEMALE THT; MPN: XT60PB-F
X4-X17 = _nanolabs_connectors:ZFKDSA1-W-6,35: TERM BLOCK 1POS 45DEG PCB; DESCRIPTION: TERM BLOCK 1POS 45DEG PCB; MPN: 1704994